# Altium schematic sheet Main.SchDoc
size 594 x 420 mm; _Razrabotal: {Разработал}; _Proveril: {Проверил}; _TKontr: {Т.контр}; _NKontr: {Н.контр}; _Utverdil: {Утвердил}
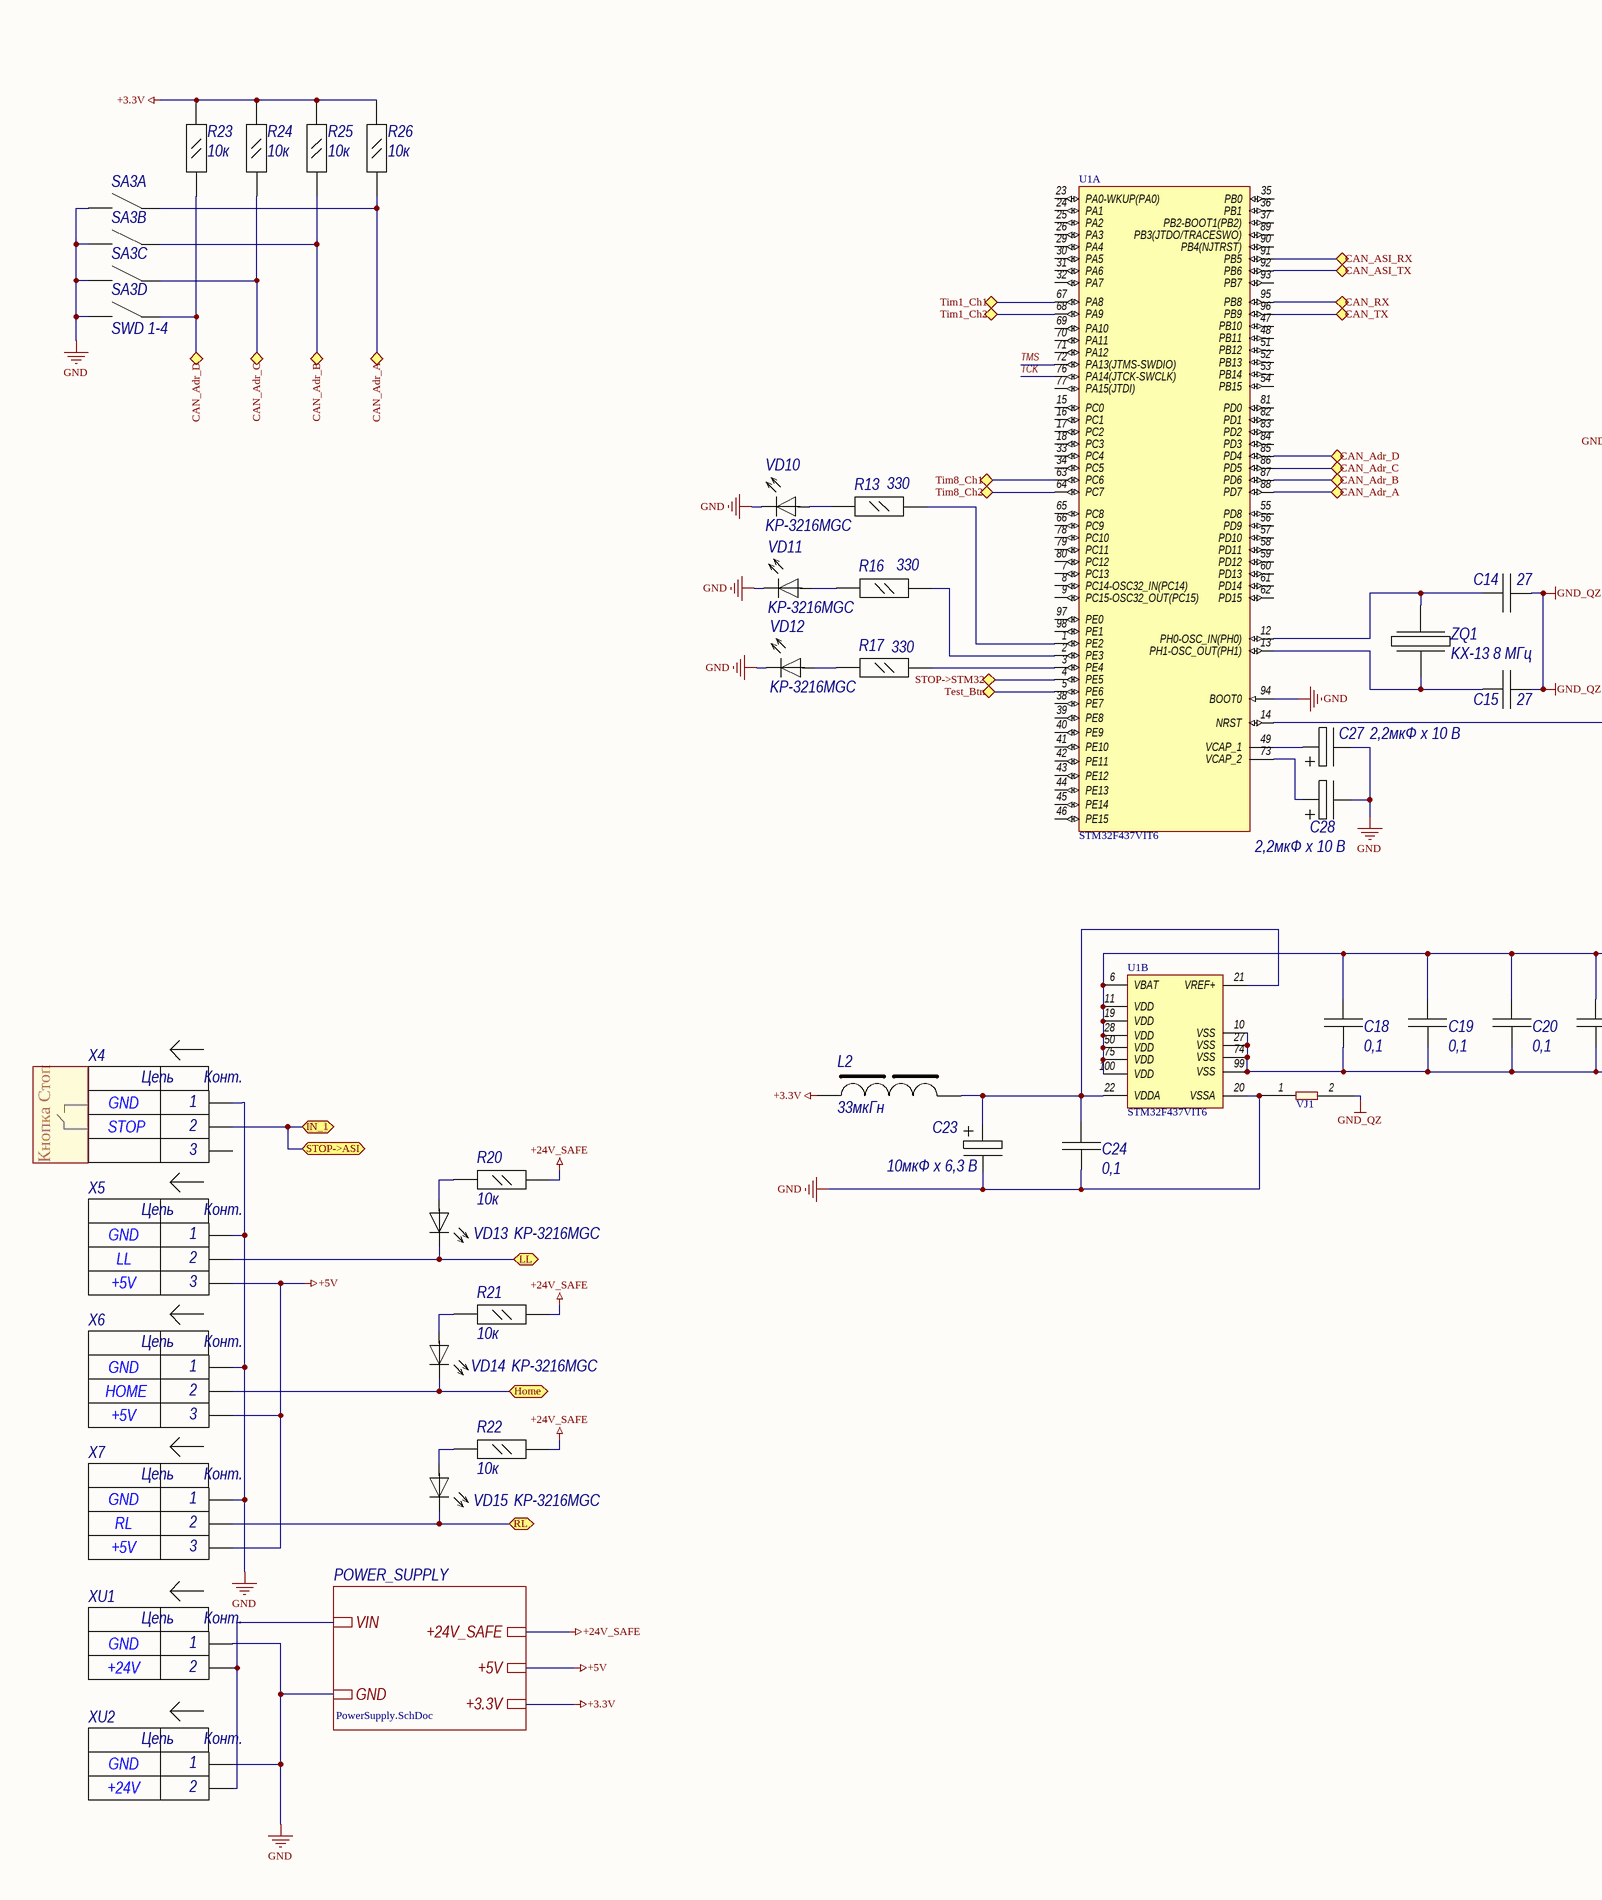
[diagram p0: Main.SchDoc, left]
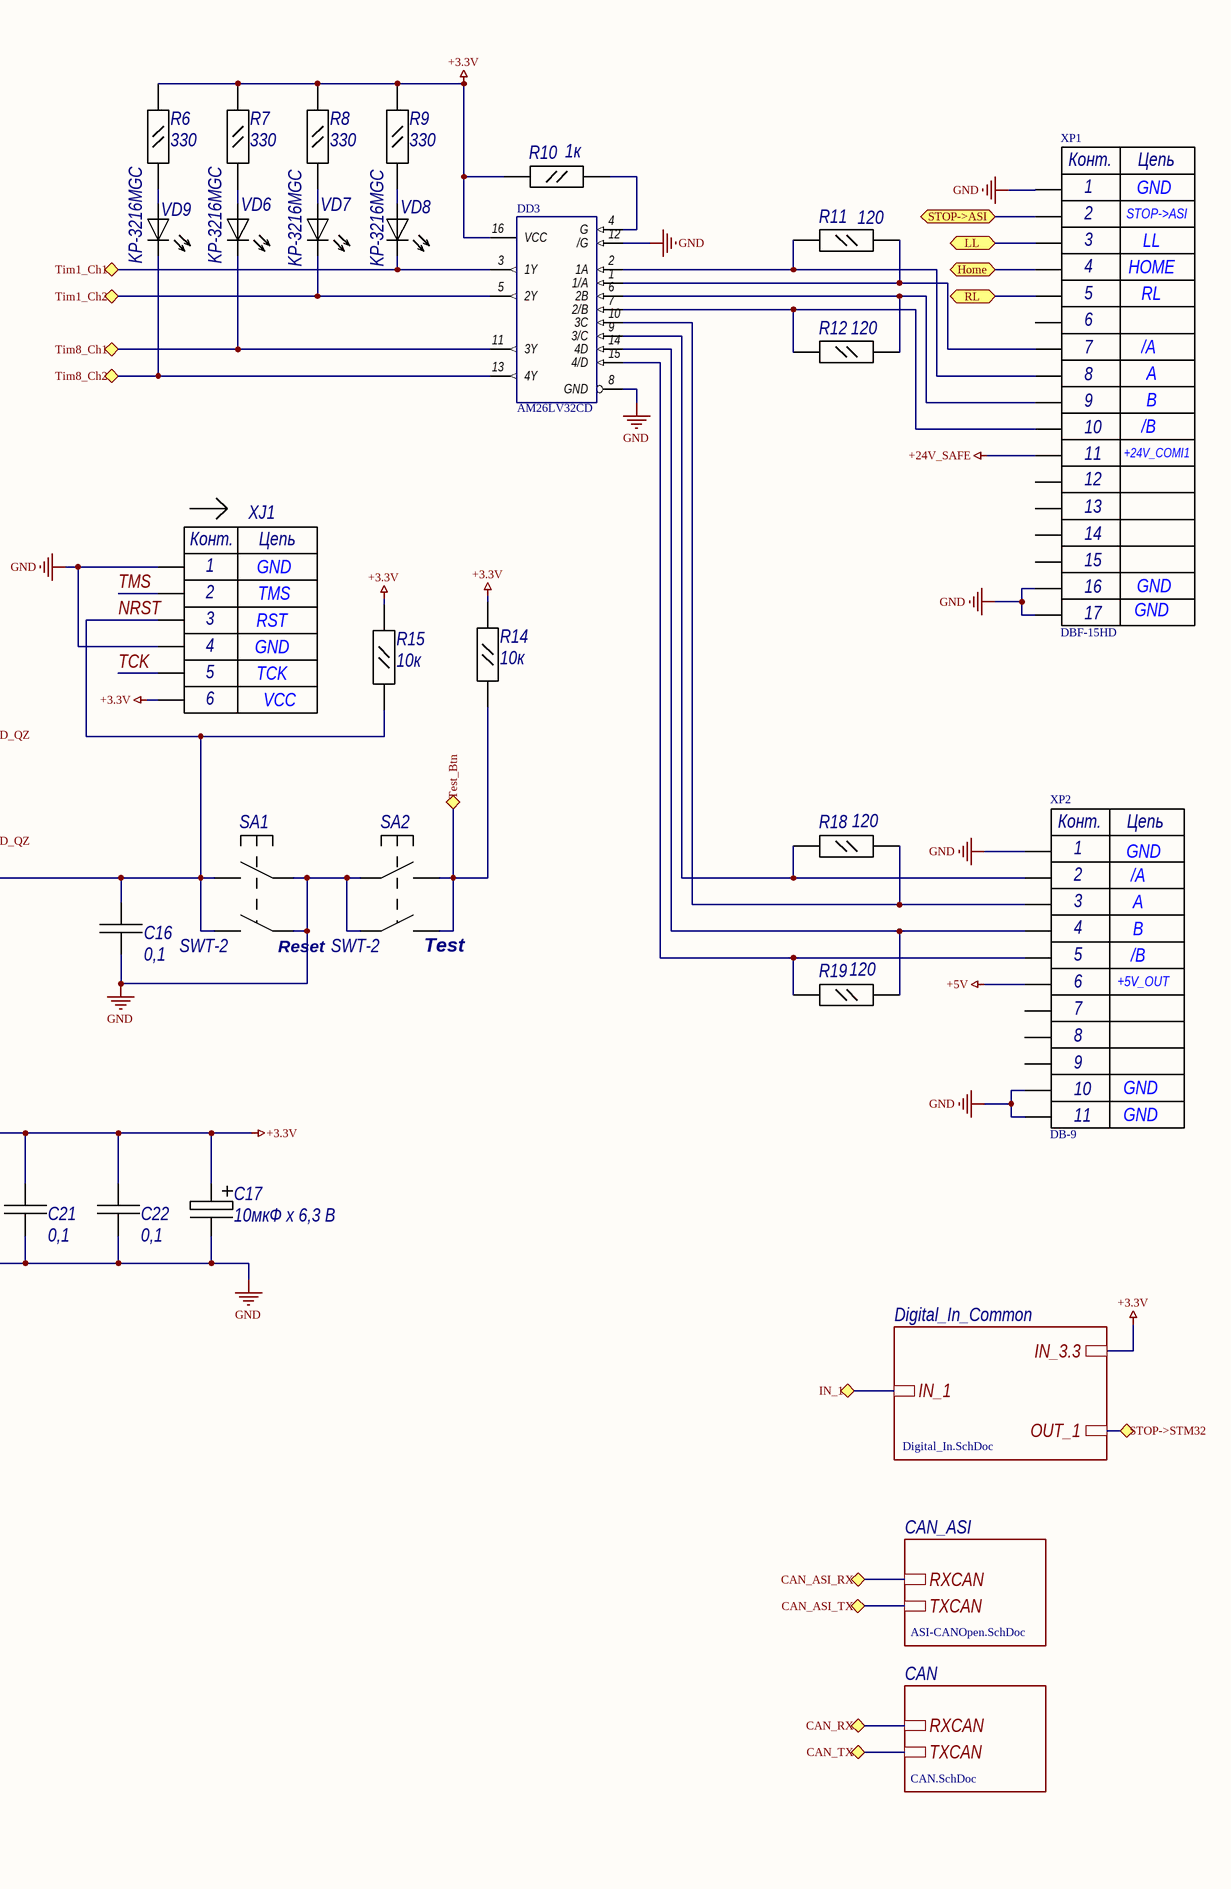
[diagram p1: Main.SchDoc, right]

## Parts
C14  27  [0805]
C15  27  [0805]
C16  0,1  [0805]
C17  10мкФ x 6,3 В  [CAP_TYPE_A]
C18  0,1  [0805]
C19  0,1  [0805]
C20  0,1  [0805]
C21  0,1  [0805]
C22  0,1  [0805]
C23  10мкФ x 6,3 В  [CAP_TYPE_A]
C24  0,1  [0805]
C27  2,2мкФ x 10 В  [CAP_TYPE_A]
C28  2,2мкФ x 10 В  [CAP_TYPE_A]
DD3  AM26LV32CD  [SO16_N]
L2  33мкГн  [CM322522]
R6  330  [0805]
R7  330  [0805]
R8  330  [0805]
R9  330  [0805]
R10  1к  [0805]
R11  120  [0805]
R12  120  [0805]
R13  330  [0805]
R14  10к  [0805]
R15  10к  [0805]
R16  330  [0805]
R17  330  [0805]
R18  120  [0805]
R19  120  [0805]
R20  10к  [0805]
R21  10к  [0805]
R22  10к  [0805]
R23  10к  [0805]
R24  10к  [0805]
R25  10к  [0805]
R26  10к  [0805]
SA1  SWT-2  [SWT-2]
SA2  SWT-2  [SWT-2]
SA3  SWD 1-4  [SWD 1-4]  (value not drawn)  (parts A,B,C,D of 4)
U1  STM32F437VIT6  [STM-LQFP100_V]  (parts A,B of 2)
VD6  KP-3216MGC  [LED3216]
VD7  KP-3216MGC  [LED3216]
VD8  KP-3216MGC  [LED3216]
VD9  KP-3216MGC  [LED3216]
VD10  KP-3216MGC  [LED3216]
VD11  KP-3216MGC  [LED3216]
VD12  KP-3216MGC  [LED3216]
VD13  KP-3216MGC  [LED3216]
VD14  KP-3216MGC  [LED3216]
VD15  KP-3216MGC  [LED3216]
VJ1  Virtual Jumper  [Virtual Jumper]  (value not drawn)  (net tie, no BOM)
X4  15EDGVC-2.5-03P  [15EDGVC-2.5-03P]  (value not drawn)
X5  15EDGVC-2.5-03P  [15EDGVC-2.5-03P]  (value not drawn)
X6  15EDGVC-2.5-03P  [15EDGVC-2.5-03P]  (value not drawn)
X7  15EDGVC-2.5-03P  [15EDGVC-2.5-03P]  (value not drawn)
XJ1  BH2-6  [BH2-6]  (value not drawn)
XP1  DBF-15HD  [DBF15 HD]
XP2  DB-9  [DB-9M]
XU1  MF-2MA  [MF-2MA]  (value not drawn)
XU2  MF-2MA  [MF-2MA]  (value not drawn)
ZQ1  KX-13 8 МГц  [KX-13]

## Sub-sheets
CAN = CAN.SchDoc: TXCAN, RXCAN
CAN_ASI = ASI-CANOpen.SchDoc: TXCAN, RXCAN
Digital_In_Common = Digital_In.SchDoc: IN_1, IN_3.3, OUT_1
POWER_SUPPLY = PowerSupply.SchDoc: VIN, +3.3V, GND, +5V, +24V_SAFE

## Ports
CAN_Adr_A, CAN_Adr_B, CAN_Adr_C, CAN_Adr_D, CAN_ASI_RX, CAN_ASI_TX, CAN_RX, CAN_TX, Home, IN_1, LL, RL, STOP->ASI, STOP->STM32, Test_Btn, Tim1_Ch1, Tim1_Ch2, Tim8_Ch1, Tim8_Ch2

## Nets
+3.3V: C17.1 C18.1 C19.1 C20.1 C21.1 C22.1 DD3.16(VCC) L2.1 R6.1 R7.2 R8.1 R9.1 R10.2 R14.2 R15.2 R23.2 R24.2 R25.2 R26.2 U1.6(VBAT) U1.11(VDD) U1.19(VDD) U1.28(VDD) U1.50(VDD) U1.75(VDD) U1.100(VDD) XJ1.6 ; sheet POWER_SUPPLY/+3.3V, sheet Digital_In_Common/IN_3.3
+5V: X5.3 X6.3 X7.3 XP2.6 ; sheet POWER_SUPPLY/+5V
+24V_SAFE: R20.2 R21.2 R22.2 XP1.11 ; sheet POWER_SUPPLY/+24V_SAFE
GND: C16.2 C17.2 C18.2 C19.2 C20.2 C21.2 C22.2 C23.2 C24.2 C27.2 C28.2 DD3.8(GND) DD3.12(/G) SA1.1 SA1.3 SA2.1 SA2.3 SA3.2 SA3.4 SA3.6 SA3.8 U1.10(VSS) U1.20(VSSA) U1.27(VSS) U1.74(VSS) U1.94(BOOT0) U1.99(VSS) VD10.2(K) VD11.2(K) VD12.2(K) VJ1.1 X4.1 X5.1 X6.1 X7.1 XJ1.1 XJ1.4 XP1.1 XP1.16 XP1.17 XP2.1 XP2.10 XP2.11 XU1.1 XU2.1 ; sheet POWER_SUPPLY/GND
GND_QZ: C14.1 C15.1 VJ1.2
CAN_Adr_A: R26.1 SA3.1 U1.88(PD7) ; port CAN_Adr_A
CAN_Adr_B: R25.1 SA3.3 U1.87(PD6) ; port CAN_Adr_B
CAN_Adr_C: R24.1 SA3.5 U1.86(PD5) ; port CAN_Adr_C
CAN_Adr_D: R23.1 SA3.7 U1.85(PD4) ; port CAN_Adr_D
CAN_ASI_RX: U1.91(PB5) ; port CAN_ASI_RX, sheet CAN_ASI/RXCAN
CAN_ASI_TX: U1.92(PB6) ; port CAN_ASI_TX, sheet CAN_ASI/TXCAN
CAN_RX: U1.95(PB8) ; port CAN_RX, sheet CAN/RXCAN
CAN_TX: U1.96(PB9) ; port CAN_TX, sheet CAN/TXCAN
Home: VD14.2(K) X6.2 XP1.4 ; port Home
IN_1: X4.2 XP1.2 ; port IN_1, port STOP->ASI, sheet Digital_In_Common/IN_1
LL: VD13.2(K) X5.2 XP1.3 ; port LL
NRST: C16.1 R15.1 SA1.2 SA1.4 U1.14(NRST) XJ1.3
RL: VD15.2(K) X7.2 XP1.5 ; port RL
STOP->STM32: U1.4(PE5) ; port STOP->STM32, sheet Digital_In_Common/OUT_1
TCK: U1.76(PA14(JTCK-SWCLK)) XJ1.5
Test_Btn: R14.1 SA2.2 SA2.4 U1.5(PE6) ; port Test_Btn
Tim1_Ch1: DD3.3(1Y) U1.67(PA8) VD8.2(K) ; port Tim1_Ch1
Tim1_Ch2: DD3.5(2Y) U1.68(PA9) VD7.2(K) ; port Tim1_Ch2
Tim8_Ch1: DD3.11(3Y) U1.63(PC6) VD6.2(K) ; port Tim8_Ch1
Tim8_Ch2: DD3.13(4Y) U1.64(PC7) VD9.2(K) ; port Tim8_Ch2
TMS: U1.72(PA13(JTMS-SWDIO)) XJ1.2
NetC14_2: C14.2 U1.12(PH0-OSC_IN(PH0)) ZQ1.1
NetC15_2: C15.2 U1.13(PH1-OSC_OUT(PH1)) ZQ1.2
NetC23_1: C23.1 C24.1 L2.2 U1.21(VREF+) U1.22(VDDA)
NetC27_1: C27.1 U1.49(VCAP_1)
NetC28_1: C28.1 U1.73(VCAP_2)
NetDD3_1: DD3.1(1/A) R11.2 XP1.7
NetDD3_2: DD3.2(1A) R11.1 XP1.8
NetDD3_4: DD3.4(G) R10.1
NetDD3_6: DD3.6(2B) R12.2 XP1.9
NetDD3_7: DD3.7(2/B) R12.1 XP1.10
NetDD3_9: DD3.9(3/C) R18.1 XP2.2
NetDD3_10: DD3.10(3C) R18.2 XP2.3
NetDD3_14: DD3.14(4D) R19.2 XP2.4
NetDD3_15: DD3.15(4/D) R19.1 XP2.5
NetR6_2: R6.2 VD9.1(A)
NetR7_1: R7.1 VD6.1(A)
NetR8_2: R8.2 VD7.1(A)
NetR9_2: R9.2 VD8.1(A)
NetR13_1: R13.1 U1.1(PE2)
NetR13_2: R13.2 VD10.1(A)
NetR16_1: R16.1 VD11.1(A)
NetR16_2: R16.2 U1.2(PE3)
NetR17_1: R17.1 VD12.1(A)
NetR17_2: R17.2 U1.3(PE4)
NetR20_1: R20.1 VD13.1(A)
NetR21_1: R21.1 VD14.1(A)
NetR22_1: R22.1 VD15.1(A)
NetXU1_2: XU1.2 XU2.2 ; sheet POWER_SUPPLY/VIN

Not connected (* = marked no-connect by the designer): U1 7(PC13) 8(PC14-OSC32_IN(PC14)) 9(PC15-OSC32_OUT(PC15)) 15(PC0) 16(PC1) 17(PC2) 18(PC3) 23(PA0-WKUP(PA0)) 24(PA1) 25(PA2) 26(PA3) 29(PA4) 30(PA5) 31(PA6) 32(PA7) 33(PC4) 34(PC5) 35(PB0) 36(PB1) 37(PB2-BOOT1(PB2)) 38(PE7) 39(PE8) 40(PE9) 41(PE10) 42(PE11) 43(PE12) 44(PE13) 45(PE14) 46(PE15) 47(PB10) 48(PB11) 51(PB12) 52(PB13) 53(PB14) 54(PB15) 55(PD8) 56(PD9) 57(PD10) 58(PD11) 59(PD12) 60(PD13) 61(PD14) 62(PD15) 65(PC8) 66(PC9) 69(PA10) 70(PA11) 71(PA12) 77(PA15(JTDI)) 78(PC10) 79(PC11) 80(PC12) 81(PD0) 82(PD1) 83(PD2) 84(PD3) 89(PB3(JTDO/TRACESWO)) 90(PB4(NJTRST)) 93(PB7) 97(PE0) 98(PE1); X4 3; XP1 6 12 13 14 15; XP2 7 8 9

## Notes on the sheet
- GND
- LL
- HOME
- STOP->ASI
- RL
- /A
- A
- B
- /B
- +24V_COMI1
- TMS
- TCK
- RST
- VCC
- (near SA1) Reset
- (near SA2) Test
- +5V_OUT
- STOP
- Кнопка Стоп
- +5V
- +24V
- Перв. примен.
- Справ. №
- Подп. и дата
- Инв.№ дубл.
- Взам. инв.№
- Изм.
- Лист
- № докум.
- Подпись
- Дата
- Лит.
- Масса
- Масштаб
- Пров.
- Т.контр.
- Разраб.
- Схема электрическая принципиальная
- Листов
- Инв. № подп.
- Н.контр.
- ООО "САН ИННОВАЦИИ"
- Утв.
- Копировал
- Формат      А2
- (in symbol 15EDGVC-2.5-03P) Цепь; Конт.
- (in symbol BH2-6) Конт.; Цепь
- (in symbol DB-9) Конт.; Цепь
- (in symbol DBF-15HD) Конт.; Цепь
- (in symbol MF-2MA) Цепь; Конт.

## Library data of the parts
C14-C16 C18-C22 C24 = CC0805: Конденсатор; Manufacturer: YAGEO; Accuracy: 10%; CVoltage: 50 В; TC Material: X7R; ComponentName: СС0805; PackageName: 0805; ComponentType: Конденсатор
  C14 C15: Value: 27
  C16 C18-C22 C24: Value: 0,1
C17 C23 = TANTAL_A: Manufacturer: Vishay; Accuracy: 20%; CVoltage: 6,3 В; ComponentName: 293D; PackageName: Тип A; ComponentType: Конденсатор электролитический танталовый; Value: 10мкФ
C27 C28 = TANTAL_A: Manufacturer: Vishay; Accuracy: 20%; CVoltage: 10 В; Value: 2,2мкФ; ComponentName: 293D; PackageName: Тип A; ComponentType: Конденсатор электролитический танталовый
DD3 = AM26LV32CDR: =ComponentName; ComponentName: AM26LV32CD; ComponentType: Микросхема
L2 = CM322522: Manufacturer: Bourns; ComponentName: CM322522-330KL; ComponentType: Дроссель; Value: 33мкГн
R6-R26 = RC0805JR: Резистор общего назначения 5%; Manufacturer: YAGEO; PackageName: 0805; ComponentType: Резистор; Accuracy: 5%; ComponentName: RC0805JR
  R6-R9 R13 R16 R17: Value: 330
  R10: Value: 1к
  R11 R12 R18 R19: Value: 120
  R14 R15 R20-R26: Value: 10к
SA3 = SWD 1-4: DIP переключатель; ComponentType: Переключатель; ComponentName: SWD 1-4
U1 = STM32F437VIT6: =ComponentName; Manufacturer: STMicroelectronics; Core: ARM Cortex-M4; D/A Converter: 2x12-bit; FLASH Size (Prog) (kB): 2048; I/Os (High Current): 82; Internal RAM Size (kB): 256; Operating Frequency(F) (Processor speed) (MHz): 168; Packing: Tray; Supply Voltage(Vcc) max (V): 3.6; Supply Voltage(Vcc) min (V): 1.8; DatasheetVersion: Rev. 1; PackageVersion: Rev. 1, 06/2013; PackageReference: LQFP100; PackageDescription: 100-Pin Low Profile Quad Flat Package, 14 x 14 mm Body, 0.5 mm Pitch; Supplier 1: Digi-Key; Supplier Part Number 1: STM32F437VIT6-ND; Supplier 2: Farnell; Supplier Part Number 2: 2333377; Supplier 3: Newark; Supplier Part Number 3: 99W9934; Supplier 4: Newark; Supplier Part Number 4: 66W7318; Supplier 5: Mouser; Supplier Part Number 5: 511-STM32F437VIT6; Mounting Technology: Surface Mount; PartNumber: STM32F437VIT6; ComponentLink1Description: Manufacturer URL; ComponentLink1URL: http://www.st.com/web/en/home.html; ComponentLink2Description: Datasheet; ComponentLink2URL: http://www.st.com/st-web-ui/static/active/en/resource/technical/document/datasheet/DM00077036.pdf; ComponentLink3Description: Package Specification; ComponentLink3URL: http://www.st.com/st-web-ui/static/active/en/resource/technical/document/data_brief/DM00071938.pdf; ComponentName: STM32F437VIT6
VD6-VD15 = KP-3216: Светодиод; Manufacturer: Kingbright; ComponentType: Светодиод; ComponentName: KP-3216MGC
VJ1 = Virt_Jumper: ComponentName: Virtual Jumper
X4-X7 = 15EDGVC-2.5-03P: Клеммник разъемный прямой; Manufacturer: DEGSON; ComponentType: Клеммник разъемный; ComponentName: 15EDGVC-2.5-03P
XJ1 = BH2-6: Вилка на плату, шаг 2.0мм; ComponentType: Разъем; ComponentName: BH2-6
XP1 = DBF-15HD: Connector DBF-15HD; ComponentName: DBF-15HD; ComponentType: Разъём
XP2 = DB-9: Connector DB-9; ComponentName: DB-9; ComponentType: Разъём
XU1 XU2 = MF-2MA: Разъем, Mini-Fit; ComponentType: Разъем; ComponentName: MF-2MA
ZQ1 = KX-13: Резонатор кварцевый; pin to pad: 2>3; Manufacturer: Geyer; ComponentType: Резонатор кварцевый; ComponentName: KX-13 8 МГц
SA1 SA2 = SWT-2: ComponentType: Кнопка тактовая; ComponentName: SWT-2